# EAGLE design RJ45_BreakOutBoard (EAGLE 9.2.2)
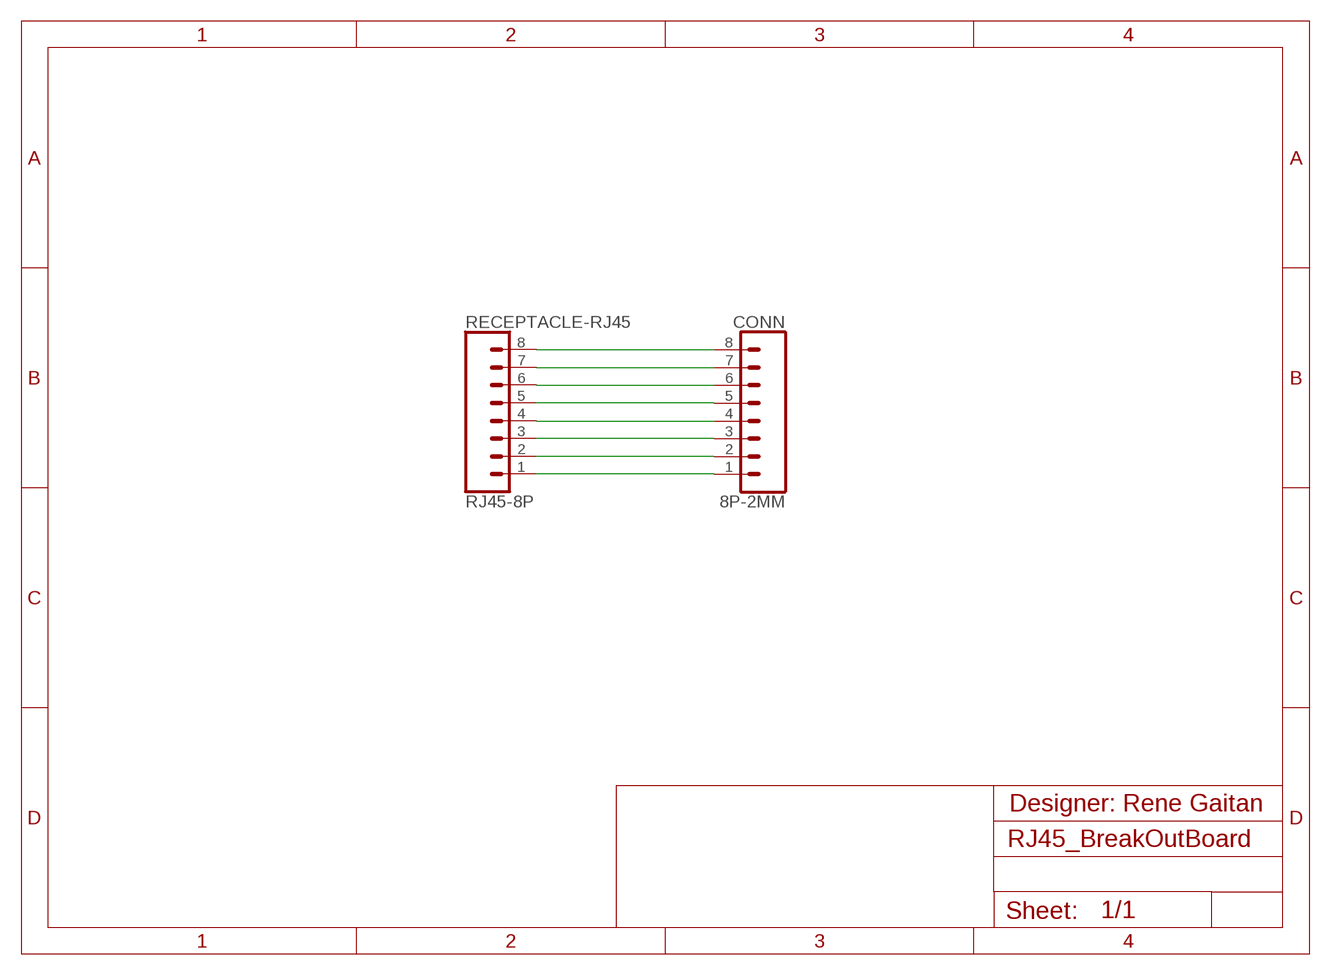
[diagram p0: schematic, sheet 1]

## Parts
CONN  8P-2MM  [1X08]
RECEPTACLE-RJ45  RJ45-8P  [RJ45-8]

## Nets
N$1: CONN.8 RECEPTACLE-RJ45.8
N$2: CONN.7 RECEPTACLE-RJ45.7
N$3: CONN.6 RECEPTACLE-RJ45.6
N$4: CONN.5 RECEPTACLE-RJ45.5
N$5: CONN.4 RECEPTACLE-RJ45.4
N$6: CONN.3 RECEPTACLE-RJ45.3
N$7: CONN.2 RECEPTACLE-RJ45.2
N$8: CONN.1 RECEPTACLE-RJ45.1

## Notes on the sheet
- Designer: Rene Gaitan

## Library data of the parts
CONN = RJ45-fARMx:8P-2MM
RECEPTACLE-RJ45 = RJ45-fARMx:RJ45-8P

## Board
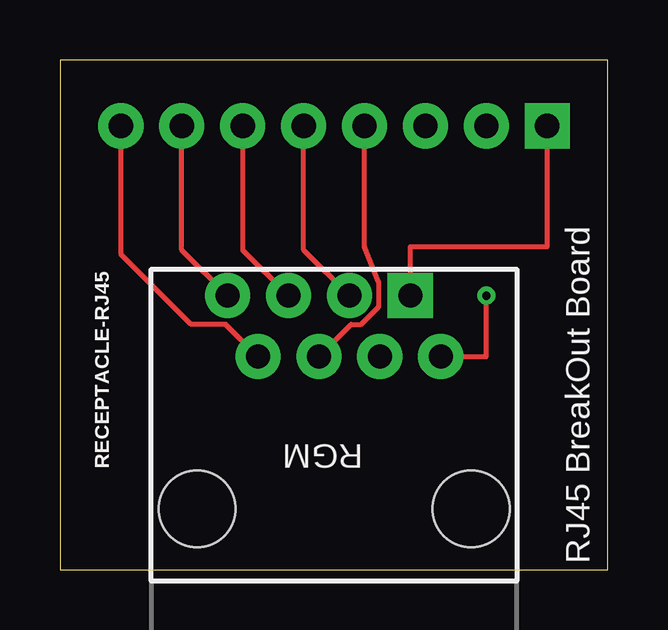
[diagram p1: board, top side]
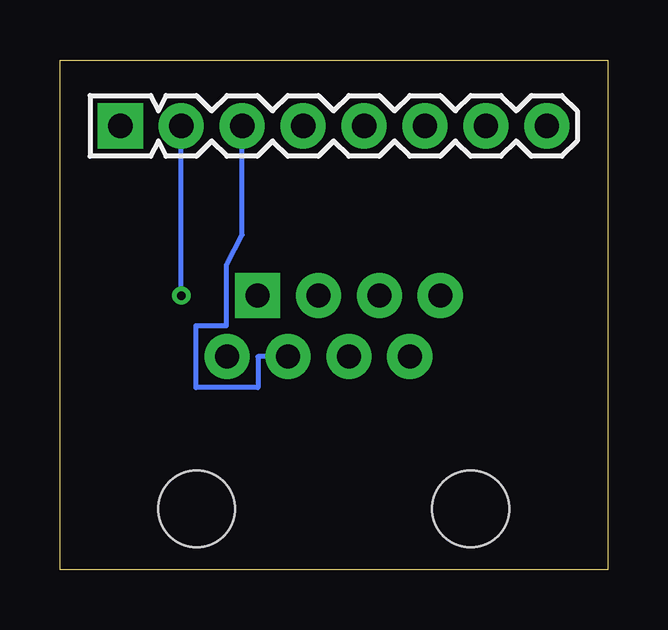
[diagram p2: board, bottom side, seen from below]

Size 22.84 x 21.26 mm. Coordinates in mm from the lower left corner, seen from the top.
Outline: 0,0 22.84,0 22.84,21.26 0,21.26 0,0
Copper layers (1*16): Top 0.035mm / dielectric 1.5mm / Bottom 0.035mm
Design rules "default": minimum track width 6mil, minimum drill 0.35mm, track to track 6mil, track to pad 6mil, pad to pad 6mil, via to via 6mil, smd to smd 6mil, copper to edge 40mil, drill to drill 6mil, minimum pad ring 10mil, minimum via ring 8mil, stop-mask expansion 4mil, vias tented up to drill 0mil, thermal gap 10mil

### Footprints (pad centres in the part's own frame; a part is rotated, then mirrored left to right if it is on the bottom)
1X08 = drill 1.016 pad 1.88 square: 1 0,0 | drill 1.016 pad 1.88: 2 2.54,0; 3 5.08,0; 4 7.62,0; 5 10.16,0; 6 12.7,0; 7 15.24,0; 8 17.78,0
RJ45-8 = drill 1 pad 1.88 square: 1 3.175,8.89 | drill 1 pad 1.88: 2 4.445,6.35; 3 1.905,6.35; 4 -0.635,6.35; 5 0.635,8.89; 6 -1.905,8.89; 7 -4.445,8.89; 8 -3.175,6.35 | hole 3.2: -5.715,0; 5.715,0

### Placement (x,y rotation side)
CONN  20.32,18.51 0 bottom
RECEPTACLE-RJ45  11.43,2.54 0 top

### Tracks (layer width: path | path; a pad name or v marks a point on that pad's centre or on a via)
N$1
  Top 0.203: RECEPTACLE-RJ45.8 6.91,10.24 5.47,10.24 2.54,13.17 CONN.8
N$2
  Top 0.203: RECEPTACLE-RJ45.7 5.08,13.34 CONN.7
N$3
  Top 0.203: RECEPTACLE-RJ45.6 7.62,13.34 CONN.6
N$4
  Top 0.203: RECEPTACLE-RJ45.5 10.16,13.34 CONN.5
N$5
  Top 0.203: RECEPTACLE-RJ45.4 12.14,10.24 12.56,10.24 13.28,10.96 13.28,12 12.7,13.46 CONN.4
N$6
  Bottom 0.203: RECEPTACLE-RJ45.3 14.58,8.89 14.58,7.59 17.17,7.59 17.17,10.18 15.9,10.18 15.9,12.72 15.24,13.97 CONN.3
N$7  (via drill 0.35)
  Top 0.203: RECEPTACLE-RJ45.2 17.78,8.89 v17.78,11.43
  Bottom 0.203: v17.78,11.43 CONN.2
N$8
  Top 0.203: RECEPTACLE-RJ45.1 14.61,13.46 20.32,13.46 CONN.1

### Text on the board
tPlace: RGM | RJ45 BreakOut Board